# EAGLE design RS232_NPN_PNP_Negative_2 (EAGLE 7.7.0)
RS232 Adapter using NPN and PNP Transistors
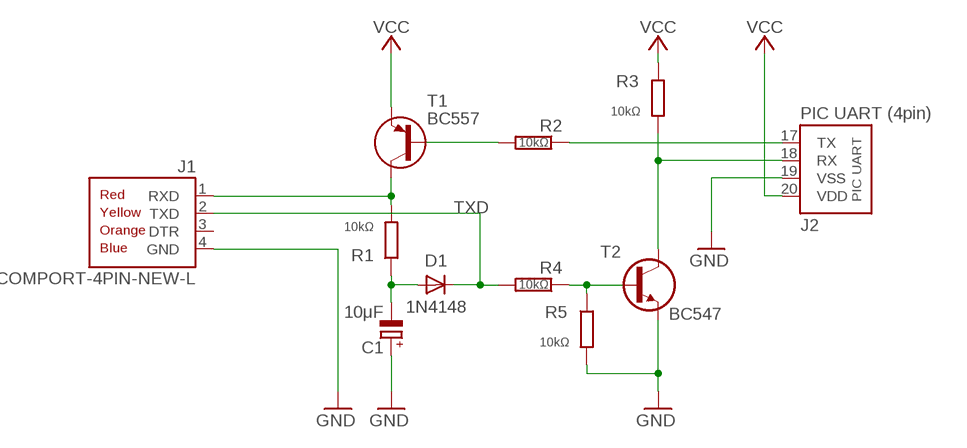
[diagram p0: schematic, sheet 1]

## Parts
C1  10μF  CPOLE2,5-3/V  [E2,5-3/V]
D1  1N4148  1N414834-5  [DO34-5]
J1  COMPORT-4PIN-NEW-L  [RS232-4PIN-NEW-L]
J2  PIC UART (4pin)  PIC-UART  [PIC-UART]
R1  10kΩ  R0202/7  [0202/7]
R2  10kΩ  R0202/10-V  [0202/10-V]
R3  10kΩ  R0202/7-V  [0202/7-V]
R4  10kΩ  R0202/7  [0202/7]
R5  10kΩ  R0202/7  [0202/7]
T1  BC557  BC557CBE  [TO92-CBE]
T2  BC547  BC547CBE  [TO92-CBE]

## Nets
-12V: C1.- D1.A R1.1
GND: C1.+ J1.4(GND) J2.19(VSS) R5.2 T2.E
N$1: R2.2 T1.B
N$6: R4.1 R5.1 T2.B
RX: J2.18(RX) R3.1 T2.C
RXD: J1.1(RXD) R1.2 T1.C
TX: J2.17(TX) R2.1
TXD: D1.C J1.2(TXD) R4.2
VCC: J2.20(VDD) R3.2 T1.E
Unconnected: J1.3(DTR)

## Library data of the parts
C1 = c:CPOL: POLARIZED CAPACITOR, European symbol
D1 = d:1N4148
J1 = pinconn:COMPORT-4PIN-NEW
J2 = pinconn:PIC-UART
R1-R5 = r:R: RESISTOR, European symbol
T1 = t:BC557
T2 = t:BC547

## Net classes
0 default: width 0.61 mm

## Board
RS232 Adapter using NPN and PNP Transistors
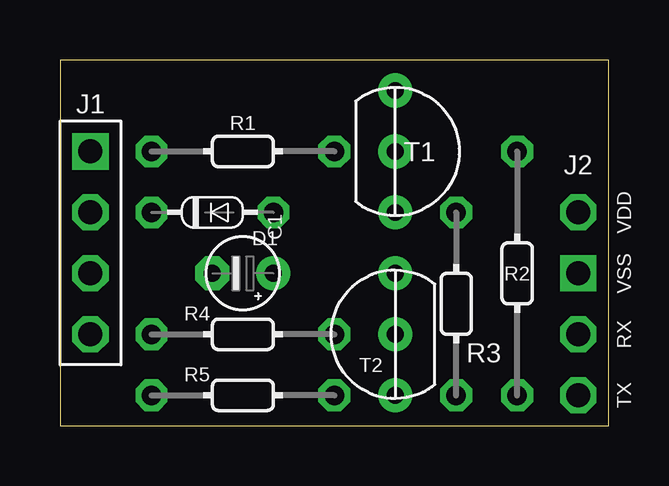
[diagram p1: board, top side]
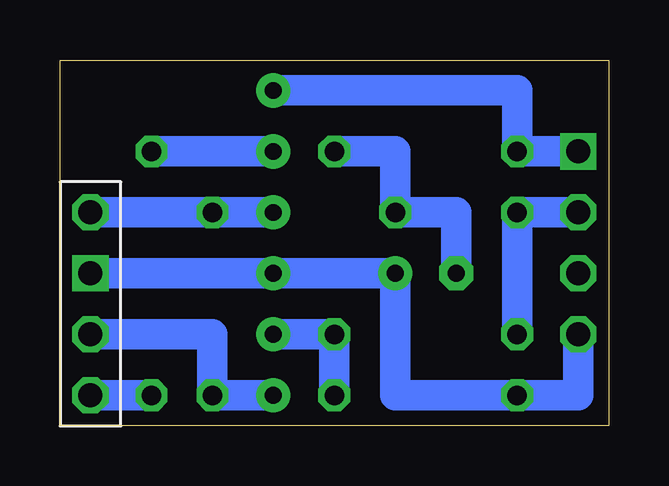
[diagram p2: board, bottom side, seen from below]

Size 22.86 x 15.24 mm. Coordinates in mm from the lower left corner, seen from the top.
Outline: 22.86,15.24 0,15.24 0,0 22.86,0 22.86,15.24
Copper layers (1*16): Top 0.035mm / dielectric 1.5mm / Bottom 0.035mm
Design rules "default": minimum track width 10mil, minimum drill 24mil, track to track 8mil, track to pad 8mil, pad to pad 8mil, via to via 8mil, smd to smd 8mil, copper to edge 40mil, drill to drill 8mil, minimum pad ring 10mil, minimum via ring 8mil, stop-mask expansion 4mil, vias tented up to drill 0mil, thermal gap 10mil

### Footprints (pad centres in the part's own frame; a part is rotated, then mirrored left to right if it is on the bottom)
E2,5-3/V = drill 0.7 pad 1.422: + 0,1.27 | drill 0.7 pad 1.422 octagon: - 0,-1.27
DO34-5 = drill 0.813 octagon: A 2.54,0; C -2.54,0
RS232-4PIN-NEW-L = drill 1 square: 1 0,-3.81 | drill 1 octagon: 2 0,-1.27; 3 0,1.27; 4 0,3.81
PIC-UART = drill 1 octagon: 17 0,0; 18 0,2.54; 20 0,7.62 | drill 1 square: 19 0,5.08
0202/7 = drill 0.813 octagon: 1 -3.81,0; 2 3.81,0
0202/10-V = drill 0.813 octagon: 1 0,-5.08; 2 0,5.08
0202/7-V = drill 0.813 octagon: 1 0,-3.81; 2 0,3.81
TO92-CBE = drill 0.7 pad 1.422: B 0,0; C 0,2.54; E 0,-2.54

### Placement (x,y rotation side)
C1  7.62,6.35 270 top
D1  6.35,8.89 0 top
J1  1.27,7.62 180 top
J2  21.59,1.27 0 top
R1  7.62,11.43 180 top
R2  19.05,6.35 0 top
R3  16.51,5.08 0 top
R4  7.62,3.81 180 top
R5  7.62,1.27 180 top
T1  13.97,11.43 0 top
T2  13.97,3.81 180 top

### Tracks (layer width: path | path; a pad name or v marks a point on that pad's centre or on a via)
-12V
  Bottom 1.27: C1.- 6.35,8.89 D1.A 8.89,11.43 R1.1
GND
  Bottom 1.27: J2.19 T2.E C1.+ 8.89,1.27 R5.2 1.27,1.27 J1.4
N$1
  Bottom 1.27: T1.B R2.2
N$6
  Bottom 1.27: T2.B R4.1 R5.1
RX
  Bottom 1.27: T2.C R3.1 16.51,3.81 J2.18
RXD
  Bottom 1.27: T1.C 3.81,13.97 R1.2 J1.1 | J1.1
TX
  Bottom 1.27: J2.17 R2.1
TXD
  Bottom 1.27: J1.2 D1.C R4.2
VCC
  Bottom 1.27: T1.E J2.20 R3.2